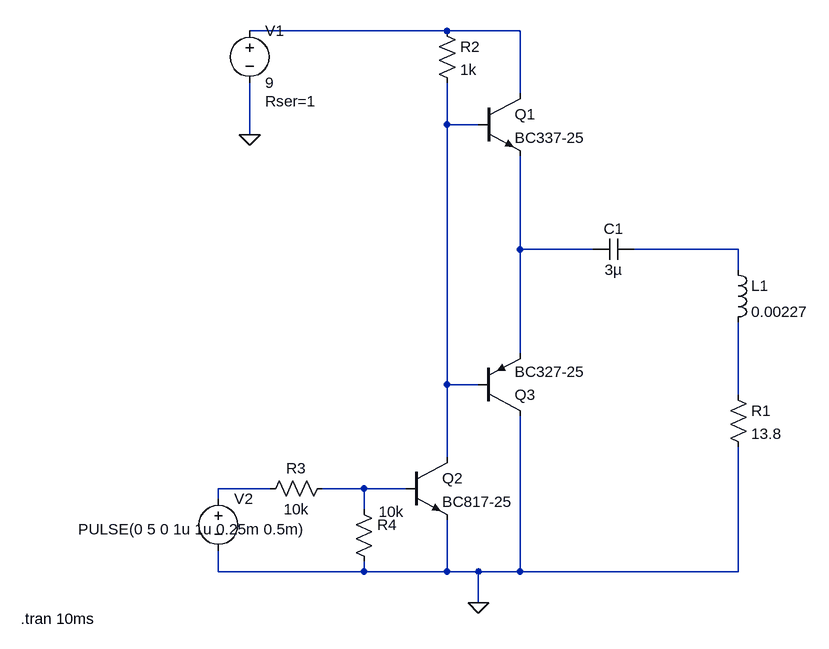
[diagram p0: schematic example.asc]
example.asc, the LTspice schematic file:
Version 4
SHEET 1 2244 680
WIRE 592 -384 288 -384
WIRE 704 -384 592 -384
WIRE 704 -288 704 -384
WIRE 592 -240 592 -304
WIRE 640 -240 592 -240
WIRE 288 -224 288 -304
WIRE 704 -48 704 -192
WIRE 816 -48 704 -48
WIRE 1040 -48 880 -48
WIRE 1040 -16 1040 -48
WIRE 704 112 704 -48
WIRE 592 160 592 -240
WIRE 640 160 592 160
WIRE 1040 176 1040 64
WIRE 592 272 592 160
WIRE 320 320 240 320
WIRE 464 320 400 320
WIRE 528 320 464 320
WIRE 240 336 240 320
WIRE 464 352 464 320
WIRE 240 448 240 416
WIRE 464 448 464 432
WIRE 464 448 240 448
WIRE 592 448 592 368
WIRE 592 448 464 448
WIRE 640 448 592 448
WIRE 704 448 704 208
WIRE 704 448 640 448
WIRE 1040 448 1040 256
WIRE 1040 448 704 448
WIRE 640 496 640 448
FLAG 640 496 0
FLAG 288 -224 0
SYMBOL pnp 640 208 M180
SYMATTR InstName Q3
SYMATTR Value BC327-25
SYMBOL ind 1024 -32 R0
SYMATTR InstName L1
SYMATTR Value 0.00227
SYMBOL cap 880 -64 R90
WINDOW 0 0 32 VBottom 2
WINDOW 3 32 32 VTop 2
SYMATTR InstName C1
SYMATTR Value 3µ
SYMBOL res 1024 160 R0
SYMATTR InstName R1
SYMATTR Value 13.8
SYMBOL voltage 288 -400 R0
WINDOW 123 0 0 Left 0
WINDOW 39 24 124 Left 2
SYMATTR SpiceLine Rser=1
SYMATTR InstName V1
SYMATTR Value 9
SYMBOL voltage 240 320 R0
WINDOW 123 0 0 Left 0
WINDOW 39 0 0 Left 0
WINDOW 3 -216 63 Left 2
SYMATTR Value PULSE(0 5 0 1u 1u 0.25m 0.5m)
SYMATTR InstName V2
SYMBOL res 576 -400 R0
SYMATTR InstName R2
SYMATTR Value 1k
SYMBOL res 416 304 R90
WINDOW 0 0 56 VBottom 2
WINDOW 3 32 56 VTop 2
SYMATTR InstName R3
SYMATTR Value 10k
SYMBOL res 448 336 R0
WINDOW 3 39 20 Left 2
SYMATTR Value 10k
SYMATTR InstName R4
SYMBOL npn 640 -288 R0
SYMATTR InstName Q1
SYMATTR Value BC337-25
SYMBOL npn 528 272 R0
SYMATTR InstName Q2
SYMATTR Value BC817-25
TEXT -64 520 Left 2 !.tran 10ms

The netlist it stands for:
* example.asc
Q3 0 N002 N003 0 BC327-25
L1 N004 N005 0.00227
C1 N004 N003 3µ
R1 N005 0 13.8
V1 N001 0 9 Rser=1
V2 N006 0 PULSE(0 5 0 1u 1u 0.25m 0.5m)
R2 N001 N002 1k
R3 N007 N006 10k
R4 N007 0 10k
Q1 N001 N002 N003 0 BC337-25
Q2 N002 N007 0 0 BC817-25
.model NPN NPN
.model PNP PNP
.lib standard.bjt
.tran 10ms
.backanno
.end